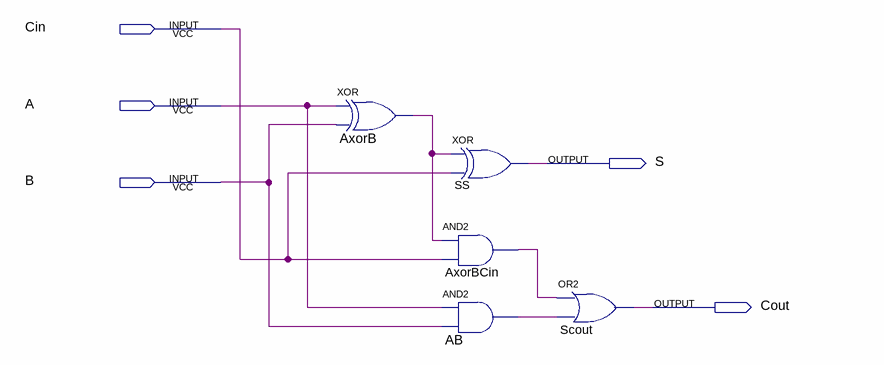
[diagram p0: schematic sheet]
// Quartus schematic ADDER_1_BIT.bdf as structural Verilog: 5 symbols, 5 pins
module ADDER_1_BIT (
  input  Cin,
  input  A,
  input  B,
  output S,
  output Cout
);

  wire AB_out, AxorB_out, AxorBCin_out;

  xor AxorB (AxorB_out, A, B);
  and AxorBCin (AxorBCin_out, AxorB_out, Cin);
  and AB (AB_out, A, B);
  xor SS (S, AxorB_out, Cin);
  or Scout (Cout, AxorBCin_out, AB_out);
endmodule
